# EAGLE design Adafruit TS3USB30 USB 1 to 2 Switch (EAGLE 9.6.2)
COMPANY: ADAFRUIT INDUSTRIES; DRAWN: KTOWN; REV: A; YEAR: 2019
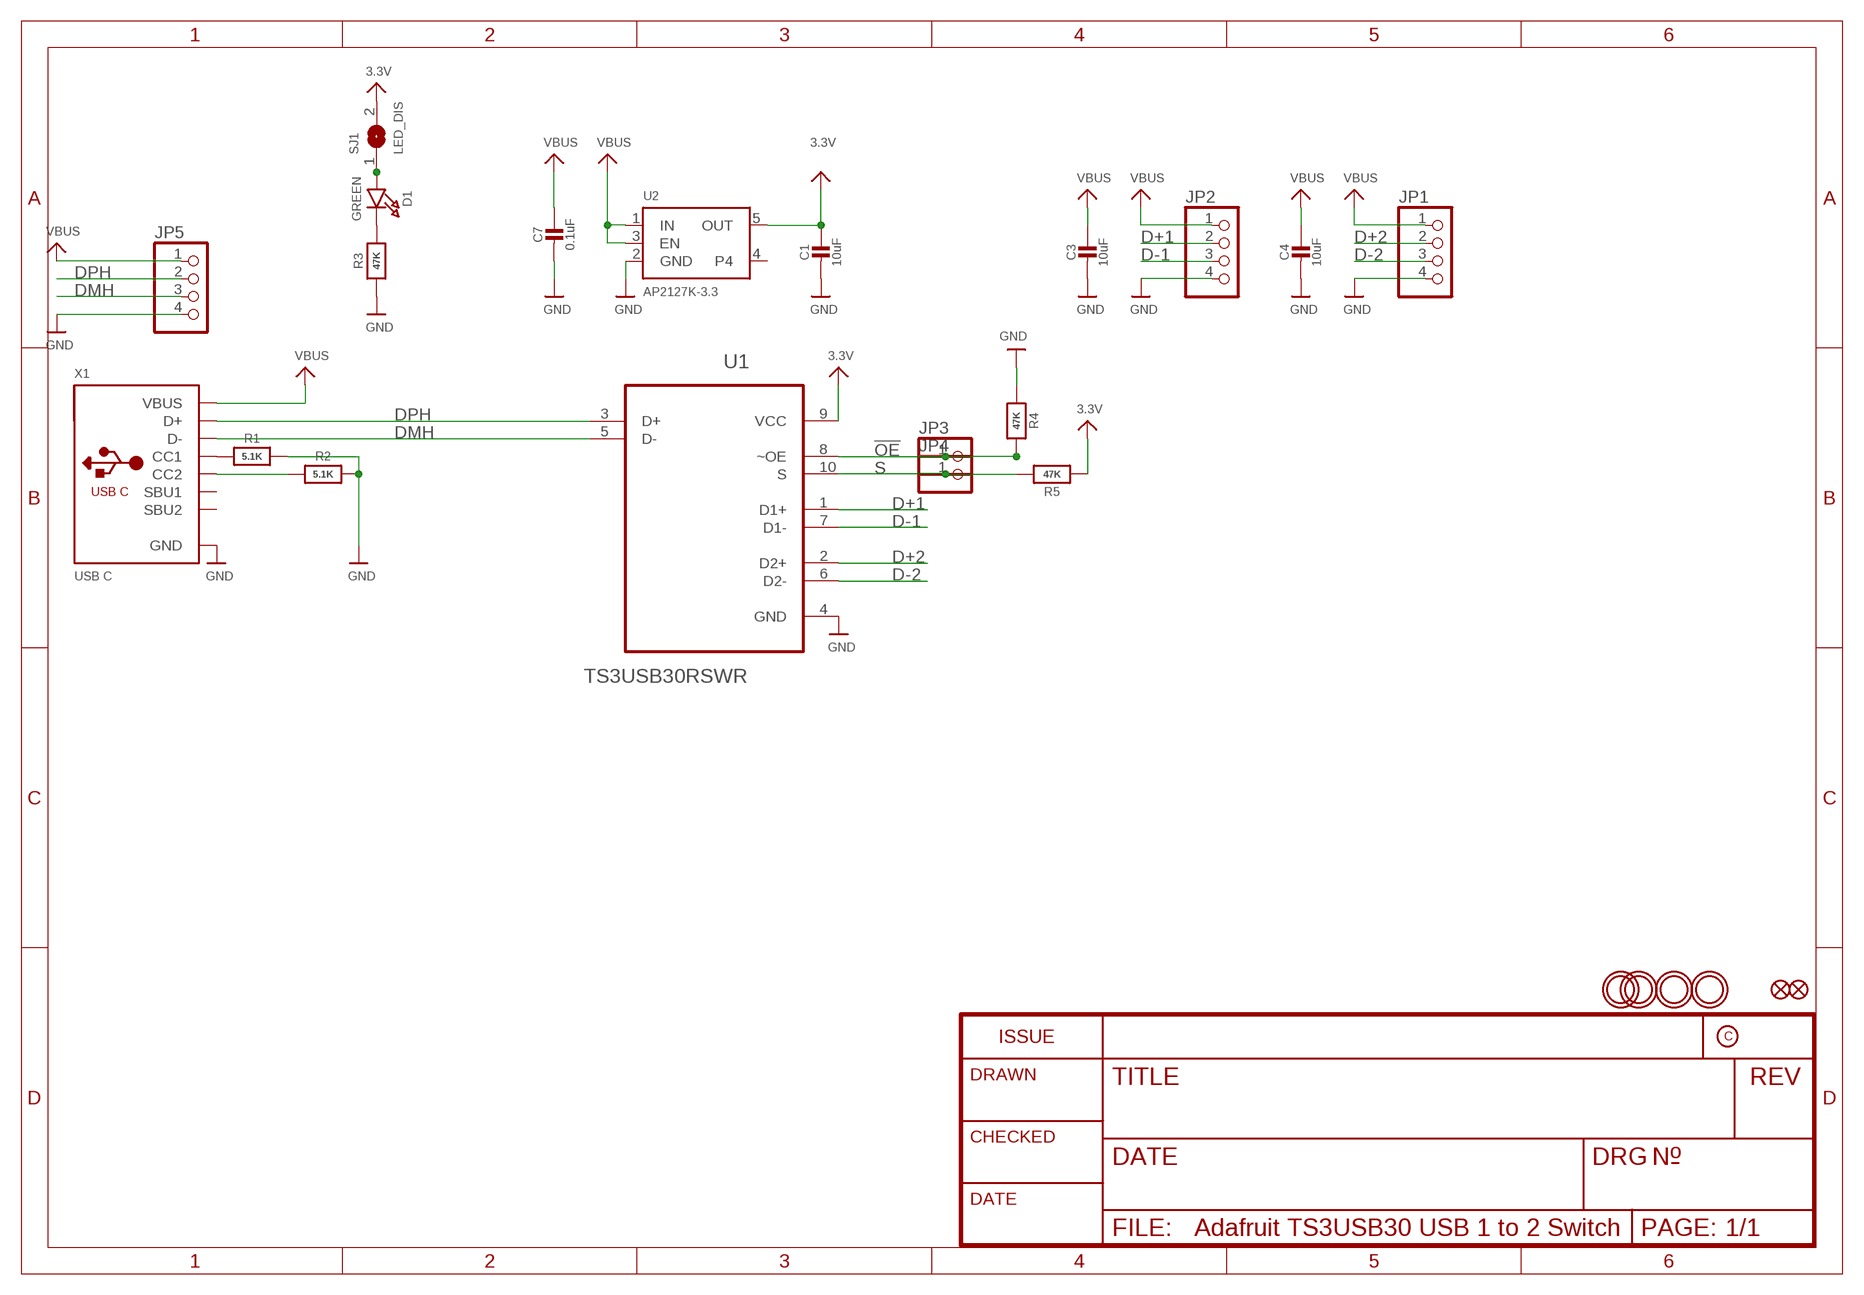
[diagram p0: schematic, sheet 1]

## Parts
C1  10uF  CAP_CERAMIC0805-NOOUTLINE  [0805-NO]
C3  10uF  CAP_CERAMIC0805-NOOUTLINE  [0805-NO]
C4  10uF  CAP_CERAMIC0805-NOOUTLINE  [0805-NO]
C7  0.1uF  CAP_CERAMIC0603_NO  [0603-NO]
D1  GREEN  LED0603_NOOUTLINE  [CHIPLED_0603_NOOUTLINE]
FID1  FIDUCIAL_1MM  [FIDUCIAL_1MM]
FID2  FIDUCIAL_1MM  [FIDUCIAL_1MM]
JP1  HEADER-1X4ROUND  [1X04_ROUND]
JP2  HEADER-1X4ROUND  [1X04_ROUND]
JP3  HEADER-1X1ROUND_76MIL  [1X01_ROUND_76MIL]
JP4  HEADER-1X1ROUND_76MIL  [1X01_ROUND_76MIL]
JP5  HEADER-1X4ROUND  [1X04_ROUND]
R1  5.1K  RESISTOR_0603_NOOUT  [0603-NO]
R2  5.1K  RESISTOR_0603_NOOUT  [0603-NO]
R3  47K  RESISTOR_0603_NOOUT  [0603-NO]
R4  47K  RESISTOR_0603_NOOUT  [0603-NO]
R5  47K  RESISTOR_0603_NOOUT  [0603-NO]
SJ1  LED_DIS  SOLDERJUMPERCLOSED  [SOLDERJUMPER_CLOSEDWIRE]
U1  TS3USB30RSWR  [10-UFQFN]
U2  AP2127K-3.3  VREG_SOT23-5  [SOT23-5]
U$23  MOUNTINGHOLE2.5  [MOUNTINGHOLE_2.5_PLATED]
U$28  MOUNTINGHOLE2.5  [MOUNTINGHOLE_2.5_PLATED]
U$29  MOUNTINGHOLE2.5  [MOUNTINGHOLE_2.5_PLATED]
U$31  MOUNTINGHOLE2.5  [MOUNTINGHOLE_2.5_PLATED]
X1  USB C  USB_C  [USB_C_CUSB31-CFM2AX-01-X]

## Nets
3.3V: C1.1 R5.1 SJ1.2 U1.9(VCC) U2.5(OUT)
!OE: JP3.1 R4.2 U1.8(~OE)
D+1: JP2.2 U1.1(D1+)
D+2: JP1.2 U1.2(D2+)
D-1: JP2.3 U1.7(D1-)
D-2: JP1.3 U1.6(D2-)
DMH: JP5.3 U1.5(D-) X1.A7(D-) X1.B7(D-)
DPH: JP5.2 U1.3(D+) X1.A6(D+) X1.B6(D+)
GND: C1.2 C3.2 C4.2 C7.2 JP1.4 JP2.4 JP5.4 R1.2 R2.2 R3.1 R4.1 U1.4(GND) U2.2(GND) X1.A1B12(GND) X1.B1A12(GND)
N$1: R1.1 X1.A5(CC1)
N$2: R2.1 X1.B5(CC2)
N$3: D1.A SJ1.1
N$5: D1.C R3.2
S: JP4.1 R5.2 U1.10(S)
VBUS: C3.1 C4.1 C7.1 JP1.1 JP2.1 JP5.1 U2.1(IN) U2.3(EN) X1.A4B9(VBUS) X1.B4A9(VBUS)
Unconnected: U2.4 X1.A8(SBU1) X1.B8(SBU2)

## Library data of the parts
C1 C3 C4 C7 = microbuilder:CAP_CERAMIC: Ceramic Capacitors For new designs, use the packages preceded by an '_' character since they are more reliable: The following footprints should be used on most boards: _0402 - Standard footprint for regular board layouts _0603 - Standard footprint for regular board layouts _0805 - Standard footprint for regular board layouts _1206 - Standard footprint for regular board layouts For extremely tight-pitch boards where space is at a premium, the following 'micro-pitch' footprints can be used (smaller pads, no silkscreen outline, etc.): _0402MP - Micro-pitch footprint for very dense/compact boards _0603MP - Micro-pitch footprint for very dense/compact boards _0805MP - Micro-pitch footprint for very dense/compact boards _1206MP - Micro-pitch footprint for very dense/compact boards
D1 = microbuilder:LED: LED 0603 - 0603 Surface Mount Package 2mA: Green LED - Low Power (3.9mcd, 2ma, 1.7Vf) - Digikey: 475-2709-2-ND Orange LED - Low Power (9.8mcd, 2ma, 1.8Vf) - Digikey: 475-1194-2-ND Red LED - Low Power (5mcd, 2ma, 1.8Vf) - Digikey: 475-1195-2-ND Yellow LED - Low Power (7mcd, 2ma, 1.8Vf) - Digikey: 475-1196-2-ND 5mA: Blue LED - Low Power (17mcd, 5ma, 2.9Vf) - Digikey: LNJ937W8CRACT-ND 0805 - 0805 Surface Mount Package 2mA: Red LED (8.8mcd, 2mA, 1.8Vf, Clear) - Low Power [Digikey: 475-2510-1-ND] Green LED (5mcd, 2mA, 1.8Vf, Clear) - Low Power [Digikey: 475-2730-1-ND] Yellow LED (11.3mcd, 2mA, 1.8Vf, Clear) - Low Power [Digikey: 475-2555-1-ND] 20mA: Red LED (104mcd, 20mA, Diffused) - LS R976 [Digikey: 475-1278-6-ND] Red LED (12mcd, 20mA, 2.0Vf, Clear) - APT2012EC [Digikey: 754-1128-1-ND] Green LED (15mcd, 20mA, 2.2Vf, Clear) - APT2012GC [Digikey: 754-1131-1-ND] Orange LED (160mcd, 20mA, 2.1Vf, Clear) - APT2012SECK [Digikey: 754-1130-1-ND] 1206 - 1206 Surface Mount Package Green LED (26mcd, 20mA, Diffused) - LG N971 [Digikey: 475-1407-6-ND] Red LED (15mcd, 20mA, Diffused) - LH N974 [Digikey: 475-1416-6-ND] Cree - Cree High-Power Surface Mount LEDs XPEBWT-L1-0000-00D50 - White 111lm 350mA 2.9Vf 6200K 110° XTEAWT-00-0000-00000LEE3 - White 114lm 350mA 2.85Vf 5000K 115° Everlight - Everlight 45-21 Series Surface Mount LEDs 45-21/QK2C-B2832AC2CB2/2T - Warm White 2000mcd 20mA 3.25Vf 3050K 120° 45-21/LK2C-B38452C4CB2/2T - Nuetral White 2000mcd 20mA 3.25Vf 4150K 120° 45-21/LK2C-B50634C6CB2/2T - Cold White 2200mcd 20mA 3.25Vf 5650K 120° PLCC2 Reverse Mount LS T77K-J1L2-1-0-2-R18-Z - Red 11.25mcd 2mA 1.8Vf 630nm 120° LO T77K-L1M2-24-Z - Orange 19.6mcd 2mA 1.8Vf 606nm 120° LY T77K-K2M1-26-Z - Yellow 15.7mcd 2mA 1.8Vf 587nm 120°; ROT: 270
FID1 FID2 = microbuilder:FIDUCIAL: Fiducial Alignment Points Various fiducial points for machine vision alignment.; BOM: EXCLUDE
JP1 JP2 JP5 = microbuilder:HEADER-1X4: PIN HEADER
JP3 JP4 = microbuilder:HEADER-1X1: PIN HEADER
R1-R5 = microbuilder:RESISTOR: Resistors For new designs, use the packages preceded by an '_' character since they are more reliable: The following footprints should be used on most boards: _0402 - Standard footprint for regular board layouts _0603 - Standard footprint for regular board layouts _0805 - Standard footprint for regular board layouts _1206 - Standard footprint for regular board layouts For extremely tight-pitch boards where space is at a premium, the following 'micro-pitch' footprints can be used (smaller pads, no silkscreen outline, etc.): _0402MP - Micro-pitch footprint for very dense/compact boards _0603MP - Micro-pitch footprint for very dense/compact boards _0805MP - Micro-pitch footprint for very dense/compact boards _1206MP - Micro-pitch footprint for very dense/compact boards
SJ1 = microbuilder:SOLDERJUMPER: SMD Solder JUMPER Solder the two pads together to create a connection, or remove the solder to break it. REFLOW - Use this footprint for solder paste and reflow ovens. WAVE - Use this footprint for hand-soldering (larger pads). CLOSED - Has a trace between the two pads to ensure it is closed by default. The trace needs to be cut to disable the jumper, and can be closed again by creating a solder bridge between the two pads.
U1 = microbuilder:TS3USB30RSWR: 1:2 MULTIPLEXER/DEMULTIPLEXER SWITCH WITH SINGLE ENABLE; DESCRIPTION: High-speed USB 2.0 (480-Mbps) 1:2 multiplexer & demultiplexer switch with single enable; DIGI-KEY_PART_NUMBER: 296-22547-2-ND; MF: Texas Instruments; MP: TS3USB30RSWR; PACKAGE: UQFN-10 Texas Instruments; PURCHASE-URL: https://pricing.snapeda.com/search?q=TS3USB30RSWR&ref=eda
U2 = adafruit_power:VREG_SOT23-5: SOT23-5 Fixed Voltage Regulators Part Current Out V Out V In V Dropout θJA (°C/W) TJ (°C) Digikey Part No. ADP121 150mA 3.3V 3.4-5.5V 0.09V @ 150mA -- -- ADP121-AUJZ33R7CT-ND ADP121 150mA 3.0V 3.1-5.5V 0.09V @ 150mA -- -- ADP121-AUJZ30R7CT-ND ADP122 300mA 3.3V 3.4-5.5V 0.085V @ 300mA -- -- ADP122AUJZ-3.3-R7CT-ND ADP1712 300mA 3.3V 3.5-5.5V 0.17V @ 300mA -- -- ADP1712AUJZ-3.3-R7TR-ND AP7311 (Low Cost) 150mA 3.3V 3.5-6V 0.15V @ 150mA -- -- AP7311-33WG-7DICT-ND LD39015M18R 150mA 1.8V 1.9V-5.5V 0.08V @ 100mA -- -- 497-6977-1-ND LP2985A-33DBVR 150mA 3.3V 3.3-16V 0.28V @ 150mA 206 150 296-18479-1-ND MCP1824T-3302E/OT 300mA 3.3V 3.5V-6V 0.2V @ 300mA -- -- MCP1824T-3302E/OTCT-ND MIC5205-2.5YM5 TR 150mA 2.5V 2.7-16V 0.165V @ 150mA -- -- 576-1257-2-ND MIC5205-3.0YM5 TR 150mA 3.0V 3.2V-16V 0.165V @ 150mA -- -- 576-1258-2-ND MIC5205-3.3YM5 TR 150mA 3.3V 3.5V-16V 0.165V @ 150mA -- -- 576-1259-2-ND TPS780330220 150mA 3.3V+2.2V 3.6-5.5V 250mV Max -- -- 296-23332-1-ND TDA3663/N1,135 100mA 3.3V 3.5-45V 0.18V @ 50mA -- -- 568-5343-1-ND Max operating temp can be calculated using θJA, TJ (max junction temperature), and power in watts. Set the "Maximum Ambient Temperature" until it reaches TJ ("Max Junction Temperature"), which is the absolute limit for safe use of the regulator: Heat Sink Temperature Calculator <http://www.daycounter.com/Calculators/Heat-Sink-Temperature-Calculator.phtml> For example, With 12V source into a 3.3V LP2985 and a 30mA load, we are dissipating (12V-3.3V) * 0.03A = 0.261W. With a θJA of 206 °C/W, a TJ of 150°C, and 261mW we can safely use the chip without a heat sink up to 75°C (=147.1°C Junction Temperature).; JLC_ROTATION: 270
U$23 U$28 U$29 U$31 = adafruit_electromech:MOUNTINGHOLE: Mounting Hole For #2 screws (0.086"/2.18mm width, 0.094"/2.4mm hole) use 2.5mm; BOM: EXCLUDE
X1 = adafruit_electromech:USB_C: USB Type-C USB 2.0 Connector; LCSC: C165948

## Board
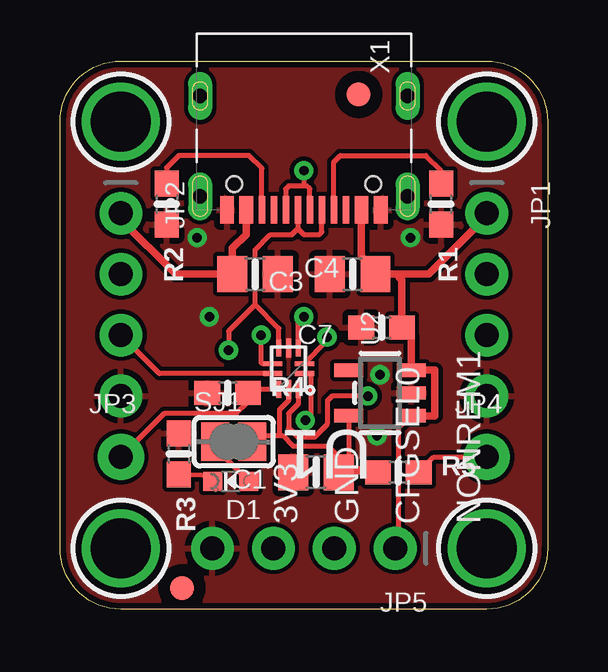
[diagram p1: board, top side]
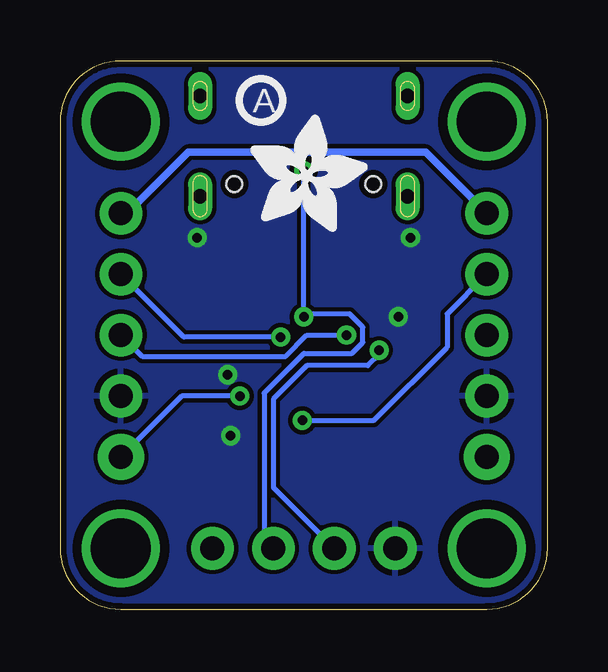
[diagram p2: board, bottom side, seen from below]

Size 20.32 x 22.86 mm. Coordinates in mm from the lower left corner, seen from the top.
Outline: 20.32,20.32 20.32,2.54 arc-90 17.78,0 2.54,0 arc-90 0,2.54 0,20.32 arc-90 2.54,22.86 17.78,22.86 arc-90 20.32,20.32
Copper layers (1*16): Top 0.035mm / dielectric 1.5mm / Bottom 0.035mm
Design rules "adafruit 7-7": minimum track width 7mil, minimum drill 15.5mil, track to track 7mil, track to pad 7mil, pad to pad 7mil, via to via 7mil, smd to smd 7mil, copper to edge 10mil, drill to drill 8mil, minimum pad ring 7mil, minimum via ring 8mil, stop-mask expansion 2mil, vias tented up to drill 20mil, thermal gap 10mil

### Footprints (pad centres in the part's own frame; a part is rotated, then mirrored left to right if it is on the bottom)
0805-NO = smd 1.24 x 1.5: 1 -0.95,0; 2 0.95,0
0603-NO = smd 1.075 x 1: 1 -0.85,0; 2 0.85,0
CHIPLED_0603_NOOUTLINE = smd 0.8 x 0.8: A 0,-0.75; C 0,0.75
FIDUCIAL_1MM = smd 1 x 1: 1 0,0
1X04_ROUND = drill 1 pad 1.778: 1 -3.81,0; 2 -1.27,0; 3 1.27,0; 4 3.81,0
1X01_ROUND_76MIL = drill 1 pad 1.93: 1 0,0
SOLDERJUMPER_CLOSEDWIRE = smd 1.168 x 1.6: 1 -0.762,0; 2 0.762,0 | smd 0.635 x 0.203: WIRE 0,0
10-UFQFN = smd 0.8 x 0.2: 1 -0.66,0.203; 2 -0.66,-0.203; 6 0.66,-0.203; 7 0.66,0.203 | smd 0.2 x 0.7: 3 -0.406,-0.864; 5 0.406,-0.864; 8 0.406,0.864; 10 -0.406,0.864 | smd 0.2 x 0.8: 4 0,-0.864; 9 0,0.864
SOT23-5 = smd 0.55 x 1.2: 1 -0.95,-1.3; 2 0,-1.3; 3 0.95,-1.3; 4 0.95,1.3; 5 -0.95,1.3
MOUNTINGHOLE_2.5_PLATED = drill 2.5 pad 3.2: P$1 0,0
USB_C_CUSB31-CFM2AX-01-X = smd 0.575 x 1.15: A1B12 -3.2,2.275; A4B9 -2.4,2.275; B1A12 3.2,2.275; B4A9 2.4,2.275 | smd 0.275 x 1.15: A5 -1.25,2.275; A6 -0.25,2.275; A7 0.25,2.275; A8 1.25,2.275; B5 1.75,2.275; B6 0.75,2.275; B7 -0.75,2.275; B8 -1.75,2.275 | drill 0.6 pad 1 long: M1 -4.32,1.7; M2 4.32,1.7; M3 -4.32,-2.48; M4 4.32,-2.48 | hole 0.65: 2.89,1.2; -2.89,1.2

### Placement (x,y rotation side)
C1  10.67,5.71 180 top
C3  12.19,13.97 180 top
C4  8.13,13.97 0 top
C7  13.4,11.75 180 top
D1  7.11,5.33 90 top
FID1  12.45,21.46 180 top
FID2  5.08,0.89 180 top
JP1  17.78,12.7 270 top
JP2  2.54,12.7 270 top
JP3  2.54,6.35 0 top
JP4  17.78,6.35 0 top
JP5  10.16,2.54 180 top
PLABEL0  [PLABEL0]  0.89,9.02 90 top
PLABEL1  [PLABEL1]  19.43,8.89 90 top
PLABEL2  [PLABEL2]  19.43,14.16 90 top
PLABEL3  [PLABEL3]  0.89,13.97 90 top
PLABEL4  [PLABEL4]  0.89,11.68 90 top
PLABEL5  [PLABEL5]  0.89,16.51 90 top
PLABEL6  [PLABEL6]  19.43,11.75 90 top
PLABEL7  [PLABEL7]  10.29,0.89 0 top
PLABEL8  [PLABEL8]  19.43,16.64 90 top
PLABEL9  [PLABEL9]  16,12.7 90 top
PLABEL10  [PLABEL10]  4.45,12.83 90 top
PLABEL11  [PLABEL11]  6.16,4.06 0 top
PLABEL12  [PLABEL12]  11.81,4.06 0 top
PLABEL13  [PLABEL13]  9.14,4.06 0 top
PLABEL14  [PLABEL14]  14.16,4.06 0 top
PLABEL15  [PLABEL15]  1.33,4.64 90 top
PLABEL16  [PLABEL16]  20.07,5.02 90 top
PLABEL17  [PLABEL17]  10.22,9.53 0 bottom
R1  15.88,16.89 270 top
R2  4.45,16.89 270 top
R3  4.95,6.48 270 top
R4  6.99,9.02 0 top
R5  14.1,5.71 0 top
SJ1  7.24,6.99 0 top
U1  9.53,10.03 180 top
U2  13.34,9.02 90 top
U$23  17.78,2.54 180 top
U$28  2.54,20.32 0 top
U$29  17.78,20.32 0 top
U$31  2.54,2.54 180 top
U$33  [ADAFRUIT_5MM]  12.38,15.75 0 bottom
U$34  [PCBFEAT-REV-040]  11.94,21.21 0 bottom
X1  10.16,18.92 180 top

### Tracks (layer width: path | path; a pad name or v marks a point on that pad's centre or on a via)
3.3V
  Top 0.203: U1.9 9.53,8.7 9.14,8.32 9.14,7.24 | U2.5 12.04,6.28 11.62,5.86 13.1,5.86 R5.1 C1.1 11.62,6.35 11.17,6.79 9.72,6.79 9.27,7.24 9.14,7.24 | SJ1.2 8.26,7.24 9.14,7.24
!OE
  Top 0.203: U1.8 7.94,9.17 7.83,9.07 R4.2 7.83,8.64 7.35,8.15 4.34,8.15 JP3.1
D+1  (via drill 0.39)
  Top 0.203: v10.22,7.87 10.26,7.87 10.44,8.05 10.44,9.83 U1.1
  Bottom 0.203: v10.22,7.87 7.24,7.87 4.19,10.92 4.19,12.32 JP2.2
D+2  (via drill 0.39)
  Top 0.203: U1.2 11.12,11.17 v11.12,11.35
  Bottom 0.203: v11.12,11.35 15.16,11.35 JP1.2
D-1
  Top 0.203: U1.7 4.14,9.83 JP2.3
D-2  (via drill 0.39)
  Top 0.203: U1.6 8.43,10.24 8.38,10.29 v8.38,11.43
  Bottom 0.203: JP1.3 16.89,10.54 10.92,10.54 10.03,11.43 v8.38,11.43
DMH  (via drill 0.39)
  Top 0.203: X1.A7 9.91,15.87 | X1.B7 10.91,15.74 10.79,15.62 10.16,15.62 9.91,15.87 | U1.5 9.12,11.71 8.13,12.7 | 8.13,12.7 8.13,14.99 8.76,15.62 9.66,15.62 9.91,15.87 | 8.13,12.7 7.02,11.6 v7.02,10.79
  Bottom 0.203: v7.02,10.79 7.02,10.63 7.49,10.16 10.03,10.16 11.43,8.76 11.43,5.08 JP5.3
DPH  (via drill 0.39)
  Top 0.203: X1.A6 10.41,17.53 10.29,17.65 10.16,17.65 | 10.16,17.65 9.53,17.65 9.4,17.53 9.4,16.66 X1.B6 | U1.3 9.93,11.96 v10.16,12.19 | v10.16,18.29 10.16,17.65
  Bottom 0.203: v10.16,18.29 v10.16,12.19 10.03,12.32 8.26,12.32 7.7,11.77 7.7,11.12 8.16,10.67 10.16,10.67 11.81,9.02 11.81,2.92 JP5.2
GND  (via drill 0.39)
  other vias: 13.21,7.24 14.61,15.49 5.71,15.49 6.22,12.19 13.34,9.78
  pour Top: 0,22.86 0,0 20.32,0 20.32,22.86
  pour Bottom: 0,22.86 0,0 20.32,0 20.32,22.86
N$1
  Top 0.203: X1.A5 11.41,18.65 11.68,18.92 15.24,18.92 15.88,18.29 R1.1
N$2
  Top 0.203: X1.B5 8.41,18.39 7.87,18.92 4.95,18.92 4.45,18.41 R2.1
N$3
  Top 0.203: D1.A 6.48,6.72 SJ1.1
N$5
  Top 0.203: D1.C 6.39,5.56 R3.2
S  (via drill 0.39)
  Top 0.203: U1.10 9.93,8.57 9.53,8.16 9.53,7.56 9.91,7.18 10.6,7.18 11.15,7.73 11.15,8.71 11.33,8.89 v12.83,8.89 | R5.2 15.58,6.35 JP4.1
  Bottom 0.203: v12.83,8.89 15.24,8.89 JP4.1
VBUS
  Top 0.203: U2.1 14.1,7.53 14.1,2.67 JP5.1
  Top 0.305: X1.A4B9 12.56,14.73 C3.1 | C3.1 14.14,13.97 14.14,13.83 14.25,13.72 C7.1 14.63,11.46 U2.3 15.62,9.97 15.62,8.07 U2.1 | C3.1 15.37,13.97 17.78,16.38 JP1.1 | X1.B4A9 7.76,15.63 7.18,15.05 C4.1 4.83,13.97 2.54,16.26 JP2.1
  Bottom 0.305: JP2.1 5.08,19.05 14.99,19.05 17.53,16.51 JP1.1

### Text on the board
tNames: 3V3 | GND | CFGSEL0 | NONREM1
Pinguin_tBackup: 5V | 5V | D+ | D+ | PORT1 | PORT2 | D- | D- | GND | GND | S | OE | GND | D- | D+ | 5V | USBHOST
Pinguin_bBackup: TS3USB30 / USB 2.0 / 1:2 Mux / Pull S low / to swap USB | Host Port